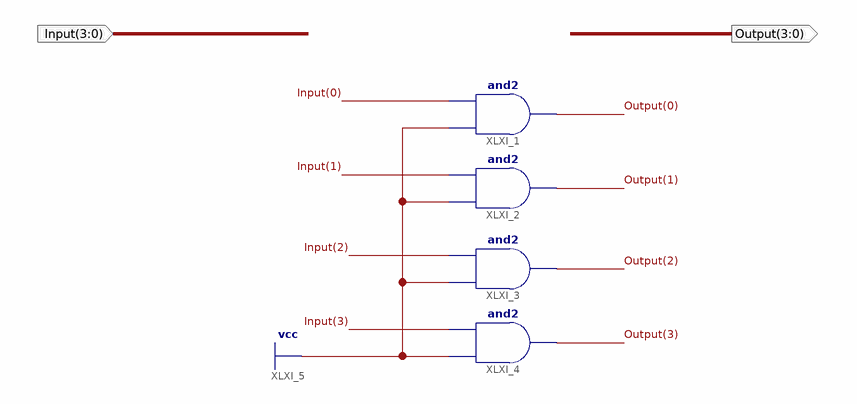
[diagram p0: schematic sheet 1]
// Xilinx ISE schematic Four_Bit_And.sch (spartan6) as structural Verilog: 4 symbols, 2 ports
module Four_Bit_And (
  input  [3:0] Input,
  output [3:0] Output
);

  and XLXI_1 (Output[0], 1'b1, Input[0]);
  and XLXI_2 (Output[1], 1'b1, Input[1]);
  and XLXI_3 (Output[2], 1'b1, Input[2]);
  and XLXI_4 (Output[3], 1'b1, Input[3]);
endmodule
